# Altium schematic sheet USB_CONSOL.SchDoc
size A
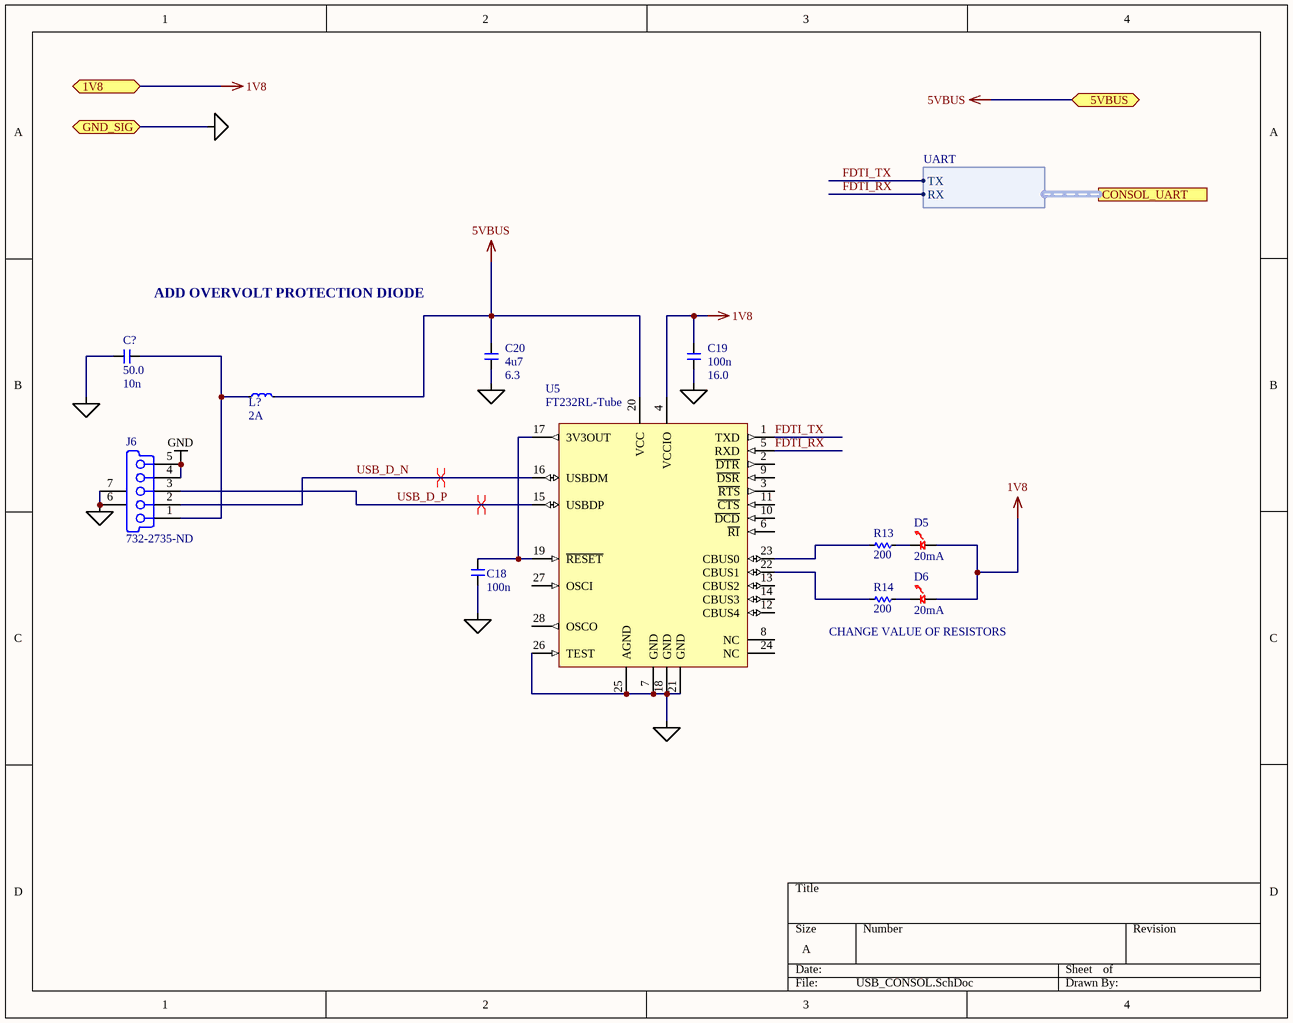
[diagram p0: USB_CONSOL.SchDoc]

## Parts
C18  human_value: 100n  [C0603]  (hidden comment: __template_cap)
C19  human_value: 100n  voltage: 16.0  [C0603]  (hidden comment: __template_cap)
C20  human_value: 4u7  voltage: 6.3  [C0603]  (hidden comment: __template_cap)
C?  voltage: 50.0  human_value: 10n  [C0603]  (hidden comment: __template_cap)
D5  Current - Test: 20mA  [0805_Diode]  (hidden comment: LED_LY974)
D6  Current - Test: 20mA  [0805_Diode]  (hidden comment: LED_LY974)
J6  732-2735-ND  [CONN_USBMINIB_VERTICAL_WE]
L?  Current Rating (Max): 2A  [R0603]
R13  value 200  [R0603]  (hidden comment: __template_resistor)
R14  value 200  [R0603]  (hidden comment: __template_resistor)
U5  FT232RL-Tube  [SSOP-28_N]

## Ports
1V8, 5VBUS, CONSOL_UART (harness UART), GND_SIG

## Harnesses
UART: TX, RX

## Nets
1V8: C19.1 D5.2 D6.2 U5.4(VCCIO) ; port 1V8
5VBUS: C20.1 L?.2 U5.20(VCC) ; port 5VBUS
GDNSIG: C18.1 C19.2 C20.2 C?.1 J6.6(MH1) J6.7(MH2) U5.7(GND) U5.18(GND) U5.21(GND) U5.25(AGND) U5.26(TEST) ; port GND_SIG
GND: J6.4(ID) J6.5(GND)
FDTI_RX: U5.5(RXD) ; port CONSOL_UART.RX
FDTI_TX: U5.1(TXD) ; port CONSOL_UART.TX
USB_D_N: J6.2(D-) U5.16(USBDM)
USB_D_P: J6.3(D+) U5.15(USBDP)
NetC18_2: C18.2 U5.17(3V3OUT) U5.19(~{RESET})
NetC?_2: C?.2 J6.1(V_BUS) L?.1
NetD5_1: D5.1 R13.2
NetD6_1: D6.1 R14.2
NetR13_1: R13.1 U5.23(CBUS0)
NetR14_1: R14.1 U5.22(CBUS1)

Not connected (* = marked no-connect by the designer): U5 2(~{DTR}) 3(~{RTS}) 6(~{RI}) 8(NC) 9(~{DSR}) 10(~{DCD}) 11(~{CTS}) 12(CBUS4) 13(CBUS2) 14(CBUS3) 24(NC) 27(OSCI) 28(OSCO)

## Layout directives
differential pair: USB_D_N, USB_D_P

## Notes on the sheet
- ADD OVERVOLT PROTECTION DIODE
- CHANGE VALUE OF RESISTORS

## Library data of the parts
C18 = 399-1097-1-ND: voltage: 16.0; type: capacitor; value: 1e-07; tolerance: 5%; Supplier Part Number 1: 399-1097-1-ND; package: 0603; price: 0.188
C19 = 478-1239-1-ND: type: capacitor; value: 1e-07; tolerance: 10%; Supplier Part Number 1: 478-1239-1-ND; package: 0603; price: 0.043
C20 = 399-3482-1-ND: type: capacitor; value: 4.7e-06; tolerance: 10%; Supplier Part Number 1: 399-3482-1-ND; package: 0603; price: 0.18
C? = 478-1227-1-ND: type: capacitor; value: 1e-08; tolerance: 10%; Supplier Part Number 1: 478-1227-1-ND; package: 0603; price: 0.04
D5 D6 = LED_LY974: LED 0805 RED 20MA; Manufacturer: OSRAM Opto Semiconductors Inc; Manufacturer Part Number: LH R974-LP-1; Wavelength - Dominant: 645nm; Wavelength - Peak: 660nm; Millicandela Rating: 41mcd; Voltage - Forward (Vf) (Typ): 1.8V; Viewing Angle: 160°; Lens Transparency: Diffused; Lens Color: White; Lens Style/Size: Rectangle with Flat Top, 1.30mm x 1.25mm; Supplier 1: Digi-Key; RoHS: RoHS Compliant; Category: Optoelectronics; Stock 1: 66379; Pricing 1: 1=0.08, 10=0.07, 100=0.0559, 250=0.04892, 500=0.04472 (USD); Packaging: Cut Tape (CT); Color: Red; Package / Case: 0805 (2012 Metric); Supplier Device Package: *; Size / Dimension: 2.00mm L x 1.25mm W; Height (Max): 0.80mm; Mounting Type: Surface Mount; ComponentLink1URL: http://www.osram-os.com/Graphics/XPic8/00078869_0.pdf; ComponentLink1Description: http://www.osram-os.com/Graphics/XPic8/00078869_0.pdf; Supplier Part Number 1: 475-1415-1-ND
J6 = CONN_USB_MINI_B_WE651005136421: USB - mini B Receptacle Connector 5 Position Through Hole, Vertical; Manufacturer: Wurth Electronics Inc; Number of Contacts: 5; Published: 30-May-2008; Publisher: Altium Limited; Supplier 1: Digi-Key; RoHS: RoHS Compliant; Stock 1: 4612; Pricing 1: 1=2.25, 10=1.95, 50=1.8376, 100=1.65, 500=1.5 (USD); Specifications: -; Supplier 2: Digi-Key; Manufacturer Part Number: 651005136421; Category: Connectors, Interconnects; Stock 2: 4612; Pricing 2: 1=2.25, 10=1.95, 50=1.8376, 100=1.65, 500=1.5 (USD); Packaging: Tray; Connector Type: USB - mini B; Gender: Receptacle; Mounting Type: Through Hole, Vertical; Features: Board Lock, Shielded; Ingress Protection: -; ComponentLink1URL: http://katalog.we-online.de/em/datasheet/651005136421.pdf; ComponentLink1Description: http://katalog.we-online.de/em/datasheet/651005136421.pdf; Supplier Part Number 2: 732-2735-ND
L? = __template_inductor: Manufacturer: Murata Electronics North America; Manufacturer Part Number: BLM18PG121SN1D; Filter Type: Power Line; Number of Lines: 1; Impedance @ Frequency: 120 Ohm @ 100MHz; DC Resistance (DCR) (Max): 50 mOhm; Supplier 1: Digi-Key; Supplier Part Number 1: 490-1037-1-ND; RoHS: RoHS Compliant; Category: Filters; Stock 1: 376636; Pricing 1: 1=0.1, 10=0.087, 50=0.0708, 100=0.0519, 250=0.03776, 500=0.0346, 1000=0.02989 (USD); Packaging: Cut Tape (CT); Ratings: -; Operating Temperature: -55°C ~ 125°C; Package / Case: 0603 (1608 Metric); Mounting Type: Surface Mount; Height (Max): 0.037" (0.95mm); Size / Dimension: 0.063" L x 0.031" W (1.60mm x 0.80mm); ComponentLink1URL: http://search.murata.co.jp/Ceramy/image/img/PDF/ENG/L0110S0100BLM18P.pdf; ComponentLink1Description: http://search.murata.co.jp/Ceramy/image/img/PDF/ENG/L0110S0100BLM18P.pdf
R13 R14 = CRCW0603200RFKEA: RES SMD 200 OHM 1% 1/10W 0603; Manufacturer: Vishay Dale; Unit Price (USD): 0.081; Power (Watts): 0.1W, 1/10W; Supplier Part Number: 541-200HCT-ND; Manufacturer Part Number: CRCW0603200RFKEA; Resistance (Machine readable): 200; type: resistor; Packaging: Cut Tape (CT); Series: CRCW; Tolerance: ±1%; Package: 0603 (1608 Metric)
U5 = FT232RL-Tube: USB UART Asynchronous Serial Data Transfer Chip, SSOP-28, Tube; Published: 19-Aug-2010; DatasheetVersion: ver 2.07, Jul-2010; PackageVersion: 2010; PackageReference: SSOP-28; Publisher: Altium Limited; PackageDescription: 28-Pin Small Outline Package 0.65 mm Pitch; ComponentLink1Description: Manufacturer Link; ComponentLink1URL: http://www.ftdichip.com/Products/ICs/FT232R.htm; ComponentLink2Description: Datasheet; ComponentLink2URL: http://www.ftdichip.com/Support/Documents/DataSheets/ICs/DS_FT232R.pdf